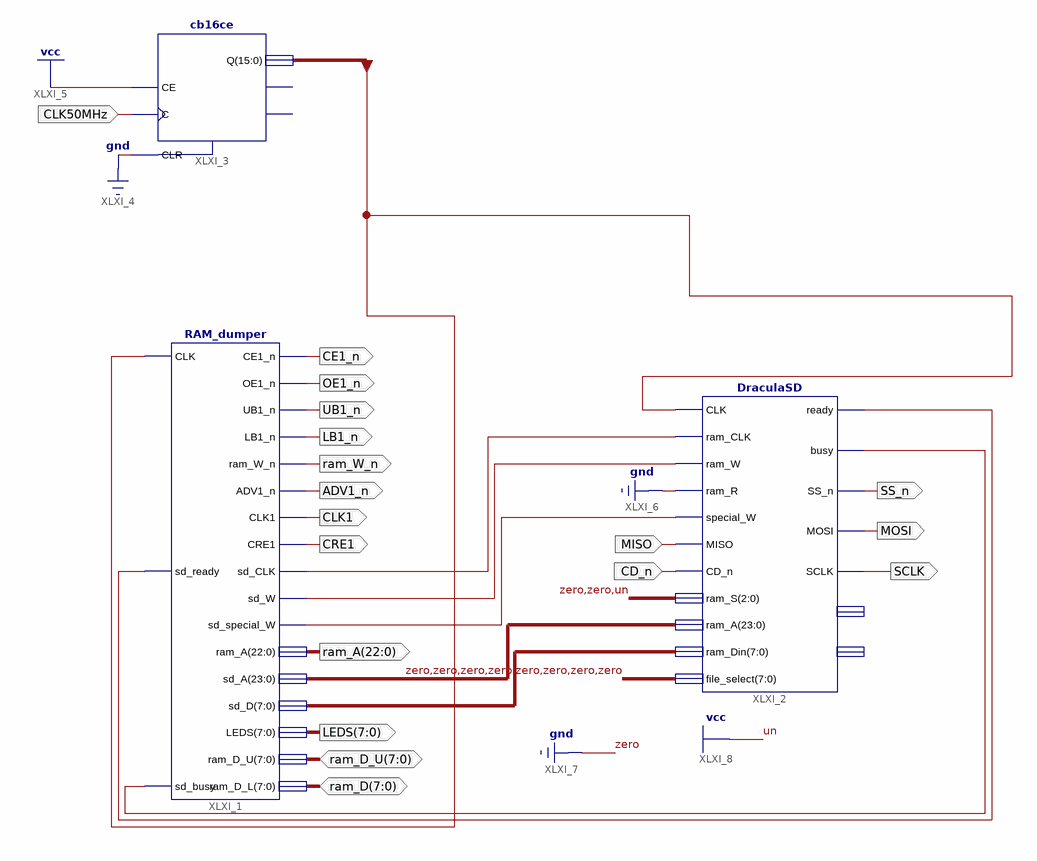
[diagram p0: schematic sheet 1]
// Xilinx ISE schematic RAM_dumper_schema.sch (spartan3e) as structural Verilog: 3 symbols, 18 ports
module RAM_dumper_schema (
  input  CLK50MHz,
  input  MISO,
  input  CD_n,
  inout  [7:0] ram_D_U,
  inout  [7:0] ram_D,
  output OE1_n,
  output UB1_n,
  output LB1_n,
  output ram_W_n,
  output CE1_n,
  output ADV1_n,
  output CLK1,
  output CRE1,
  output [22:0] ram_A,
  output MOSI,
  output SS_n,
  output SCLK,
  output [7:0] LEDS
);

  wire XLXN_55, XLXN_56, XLXN_57, XLXN_60, XLXN_61;
  wire [7:0] XLXN_63;
  wire [15:0] CLK_DIV;
  wire [23:0] XLXN_62;

  cb16ce XLXI_3 (.C(CLK50MHz), .CE(1'b1), .CLR(1'b0), .Q(CLK_DIV));  // open: CEO, TC
  RAM_dumper XLXI_1 (
    .CLK(CLK_DIV[2]), .sd_ready(XLXN_60), .sd_busy(XLXN_61), .CE1_n(CE1_n), .OE1_n(OE1_n), .UB1_n(UB1_n),
    .LB1_n(LB1_n), .ram_W_n(ram_W_n), .ADV1_n(ADV1_n), .CLK1(CLK1), .CRE1(CRE1), .sd_CLK(XLXN_55),
    .sd_W(XLXN_56), .sd_special_W(XLXN_57), .ram_A(ram_A), .sd_A(XLXN_62), .sd_D(XLXN_63), .LEDS(LEDS),
    .ram_D_U(ram_D_U), .ram_D_L(ram_D));
  DraculaSD XLXI_2 (
    .CLK(CLK_DIV[2]), .ram_CLK(XLXN_55), .ram_W(XLXN_56), .ram_R(1'b0), .special_W(XLXN_57), .MISO(MISO),
    .CD_n(CD_n), .ram_S(3'b001), .ram_A(XLXN_62), .ram_Din(XLXN_63), .file_select({8{1'b0}}),
    .ready(XLXN_60), .busy(XLXN_61), .SS_n(SS_n), .MOSI(MOSI), .SCLK(SCLK));  // open: ram_Dout, leds
endmodule
